# EasyEDA schematic schematic.json
TITLE: CNC Plotter; REV: 1.0; Date: 2024-08-05; Sheet: 1/1; Drawn By: Errol Rodrigues; Company: GEEKBOTS
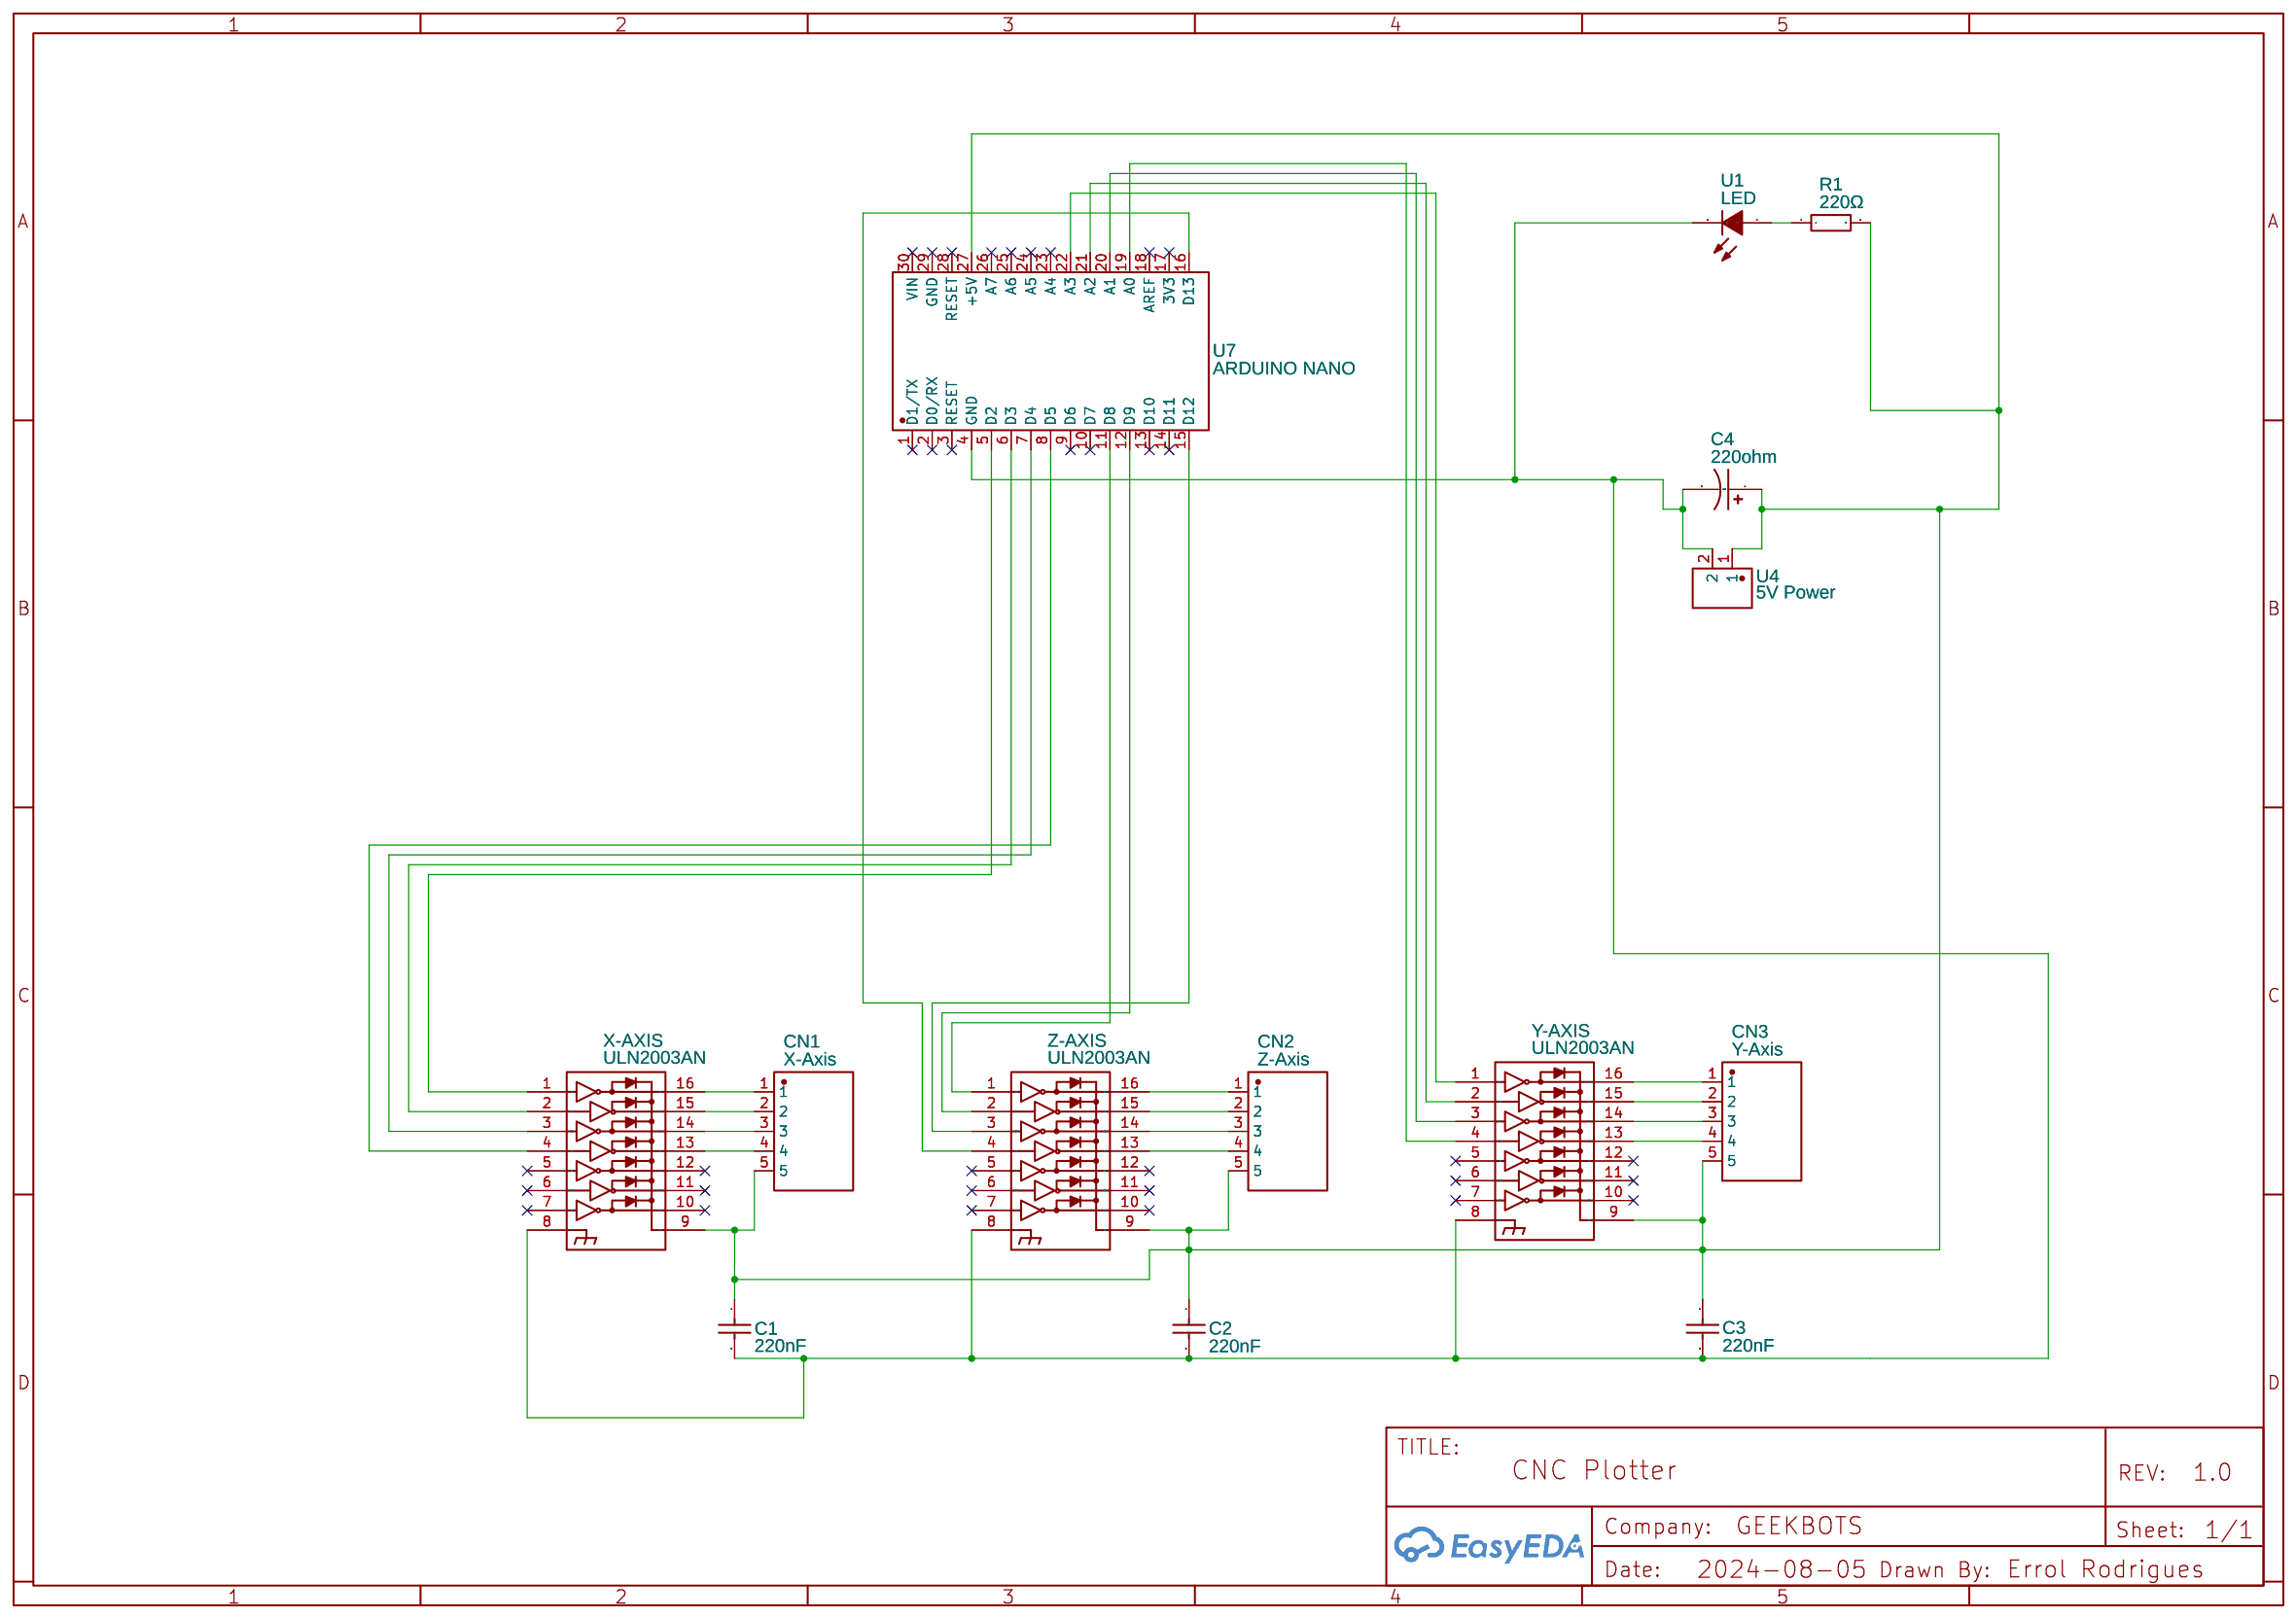
[diagram p0: schematic sheet]

## Parts
C1  220nF  [CAP-TH_L5.0-W2.5-P5.08-D0.7]
C2  220nF  [CAP-TH_L5.0-W2.5-P5.08-D0.7]
C3  220nF  [CAP-TH_L5.0-W2.5-P5.08-D0.7]
C4  220ohm  [CAP-TH_BD6.3-P2.50-D0.5-FD]
CN1  X-Axis  [CONN-TH_B5B-XH-A-LF-SN]
CN2  Z-Axis  [CONN-TH_B5B-XH-A-LF-SN]
CN3  Y-Axis  [CONN-TH_B5B-XH-A-LF-SN]
R1  220Ω  [RES-TH_BD2.3-L6.5-P10.50-D0.5]
U1  LED  [LED-TH_BD5.0-P2.54-FD]
U4  5V Power  [CONN-TH_XY126V-5.0-2P]
U7  ARDUINO NANO  [COMM-TH_ARDUINO_NANO]
X-AXIS  ULN2003AN  [DIP-16_16P-L20.2-W6.6-P2.54-LS7.6-BL]
Y-AXIS  ULN2003AN  [DIP-16_16P-L20.2-W6.6-P2.54-LS7.6-BL]
Z-AXIS  ULN2003AN  [DIP-16_16P-L20.2-W6.6-P2.54-LS7.6-BL]

## Library data of the parts
C1-C3 = CD1H224KC9BER1E000: Contributor: LCSC; Supplier: LCSC; Supplier Part: C263191; Manufacturer: Dersonic(德尔创); JLCPCB Part Class: Extended Part
C4 = 226BPS035M: Supplier: LCSC; Supplier Part: C7172434; Manufacturer: Illinois Capacitor; Contributor: lcsc; JLCPCB Part Class: Extended Part
CN1-CN3 = B5B-XH-A (LF)(SN): Contributor: LCSC; Supplier: LCSC; Supplier Part: C157991; Manufacturer: JST; Manufacturer Part: B5B-XH-A(LF)(SN); JLCPCB Part Class: Extended Part
R1 = MF1/4W-300KΩ±1% T52: Contributor: LCSC; Supplier: LCSC; Supplier Part: C119377; Manufacturer: CCO(千志电子); Manufacturer Part: MF1/4W-300KΩ±1% T; JLCPCB Part Class: Extended Part
U1 = IR333C-A(BY)(N): Supplier: LCSC; Supplier Part: C17179509; Manufacturer: EVERLIGHT(亿光); Contributor: lcsc
U4 = XY126V-5.0-2P: Contributor: LCSC; Supplier: LCSC; Supplier Part: C557646; Manufacturer: XINLAIYA(新莱亚); JLCPCB Part Class: Extended Part
U7 = ARDUINO_NANO: Contributor: lcsc; Supplier: LCSC; Supplier Part: C9900017879; Manufacturer: null; JLCPCB Part Class: Extended Part
X-AXIS Y-AXIS Z-AXIS = ULN2003AN: Supplier: LCSC; Manufacturer: TI(德州仪器); Supplier Part: C90448; JLCPCB Part Class: Extended Part

## Nets
Net-(C1-1): C1.1 C2.1 C3.1 C4.1 CN1.5 CN2.5 CN3.5 R1.2 U4.1 U7.27(+5V) X-AXIS.9(COM) Y-AXIS.9(COM) Z-AXIS.9(COM)
Net-(C1-2): C1.2 C2.2 C3.2 C4.2 U1.2(C) U4.2 U7.4(GND) X-AXIS.8(E) Y-AXIS.8(E) Z-AXIS.8(E)
Net-(CN1-1): CN1.1 X-AXIS.16(1C)
Net-(CN1-2): CN1.2 X-AXIS.15(2C)
Net-(CN1-3): CN1.3 X-AXIS.14(3C)
Net-(CN1-4): CN1.4 X-AXIS.13(4C)
Net-(CN2-1): CN2.1 Z-AXIS.16(1C)
Net-(CN2-2): CN2.2 Z-AXIS.15(2C)
Net-(CN2-3): CN2.3 Z-AXIS.14(3C)
Net-(CN2-4): CN2.4 Z-AXIS.13(4C)
Net-(CN3-1): CN3.1 Y-AXIS.16(1C)
Net-(CN3-2): CN3.2 Y-AXIS.15(2C)
Net-(CN3-3): CN3.3 Y-AXIS.14(3C)
Net-(CN3-4): CN3.4 Y-AXIS.13(4C)
Net-(R1-1): R1.1 U1.1(A)
Net-(U7-5): U7.5(D2) X-AXIS.1(1B)
Net-(U7-6): U7.6(D3) X-AXIS.2(2B)
Net-(U7-7): U7.7(D4) X-AXIS.3(3B)
Net-(U7-8): U7.8(D5) X-AXIS.4(4B)
Net-(U7-11): U7.11(D8) Z-AXIS.1(1B)
Net-(U7-12): U7.12(D9) Z-AXIS.2(2B)
Net-(U7-15): U7.15(D12) Z-AXIS.3(3B)
Net-(U7-16): U7.16(D13) Z-AXIS.4(4B)
Net-(U7-19): U7.19(A0) Y-AXIS.4(4B)
Net-(U7-20): U7.20(A1) Y-AXIS.3(3B)
Net-(U7-21): U7.21(A2) Y-AXIS.2(2B)
Net-(U7-22): U7.22(A3) Y-AXIS.1(1B)

Not connected (* = marked no-connect by the designer): U7 1(D1/TX)* 2(D0/RX)* 3(RESET)* 9(D6)* 10(D7)* 13(D10)* 14(D11)* 17(3V3)* 18(AREF)* 23(A4)* 24(A5)* 25(A6)* 26(A7)* 28(RESET)* 29(GND)* 30(VIN)*; X-AXIS 5(5B)* 6(6B)* 7(7B)* 10(7C)* 11(6C)* 12(5C)*; Y-AXIS 5(5B)* 6(6B)* 7(7B)* 10(7C)* 11(6C)* 12(5C)*; Z-AXIS 5(5B)* 6(6B)* 7(7B)* 10(7C)* 11(6C)* 12(5C)*
